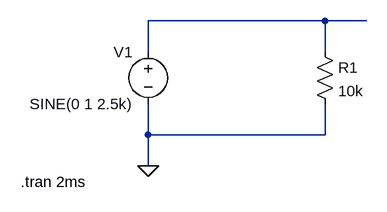
[diagram p0: schematic 2_2SineNoOffset.asc]
2_2SineNoOffset.asc, the LTspice schematic file:
Version 4
SHEET 1 880 680
WIRE 416 0 144 0
WIRE 480 0 416 0
WIRE 144 48 144 0
WIRE 416 48 416 0
WIRE 144 176 144 128
WIRE 416 176 416 128
WIRE 416 176 144 176
WIRE 144 224 144 176
FLAG 144 224 0
SYMBOL voltage 144 32 M0
WINDOW 123 0 0 Left 0
WINDOW 39 0 0 Left 0
SYMATTR InstName V1
SYMATTR Value SINE(0 1 2.5k)
SYMBOL res 400 32 R0
SYMATTR InstName R1
SYMATTR Value 10k
TEXT -52 248 Left 2 !.tran 2ms

The netlist it stands for:
* 2_2SineNoOffset.asc
V1 N001 0 SINE(0 1 2.5k)
R1 N001 0 10k
.tran 2ms
.backanno
.end